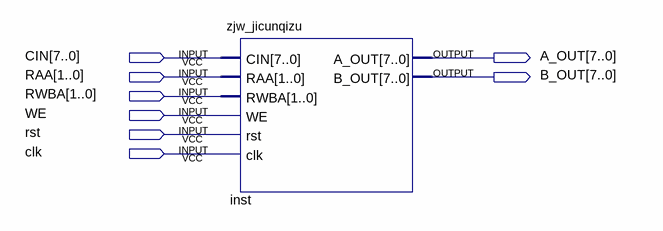
[diagram p0: schematic sheet]
// Quartus schematic Block1.bdf as structural Verilog: 1 symbols, 8 pins
module Block1 (
  input  [7:0] CIN,
  input  [1:0] RAA,
  input  [1:0] RWBA,
  input  WE,
  input  rst,
  input  clk,
  output [7:0] A_OUT,
  output [7:0] B_OUT
);

  zjw_jicunqizu inst (.CIN(CIN), .RAA(RAA), .RWBA(RWBA), .WE(WE), .rst(rst), .clk(clk), .A_OUT(A_OUT), .B_OUT(B_OUT));
endmodule
